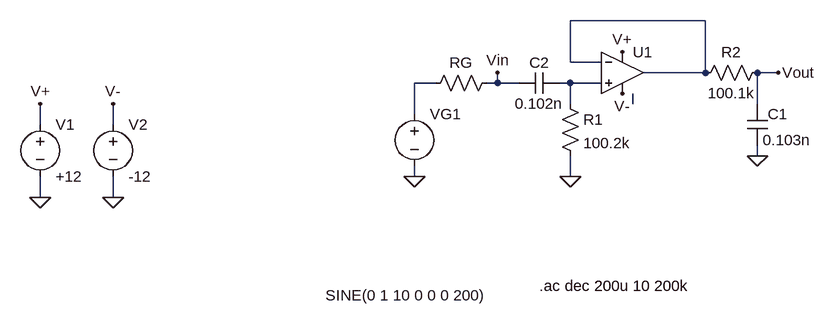
[diagram p0: schematic shaper_bode.asc]
shaper_bode.asc, the LTspice schematic file:
Version 4
SHEET 1 880 680
WIRE -224 -112 -432 -112
WIRE -432 -48 -432 -112
WIRE -384 -48 -432 -48
WIRE -224 -32 -224 -112
WIRE -224 -32 -320 -32
WIRE -112 -32 -144 -32
WIRE -640 -16 -672 -16
WIRE -544 -16 -544 -32
WIRE -544 -16 -560 -16
WIRE -512 -16 -544 -16
WIRE -432 -16 -448 -16
WIRE -384 -16 -432 -16
WIRE -432 16 -432 -16
WIRE -336 16 -336 0
WIRE -144 16 -144 -32
WIRE -672 32 -672 -16
WIRE -1248 48 -1248 16
WIRE -1136 48 -1136 16
WIRE -144 96 -144 80
WIRE -672 128 -672 112
WIRE -432 128 -432 96
WIRE -1248 160 -1248 128
WIRE -1136 160 -1136 128
FLAG -1248 160 0
FLAG -1136 160 0
FLAG -1248 16 V+
FLAG -1136 16 V-
FLAG -112 -32 Vout
FLAG -544 -32 Vin
FLAG -352 0 V-
FLAG -352 -64 V+
FLAG -672 128 0
FLAG -432 128 0
FLAG -144 96 0
SYMBOL voltage -1248 32 R0
WINDOW 123 24 126 Left 2
WINDOW 39 24 111 Left 2
SYMATTR InstName V1
SYMATTR Value +12
SYMBOL voltage -1136 32 R0
WINDOW 123 24 126 Left 2
WINDOW 39 24 111 Left 2
SYMATTR InstName V2
SYMATTR Value -12
SYMBOL Opamps/UniversalOpamp2 -352 -32 R0
SYMATTR InstName U1
SYMBOL voltage -672 16 R0
WINDOW 3 -137 295 Left 2
WINDOW 39 0 0 Left 0
SYMATTR Value SINE(0 1 10 0 0 0 200)
SYMATTR Value2 AC 1 0
SYMATTR InstName VG1
SYMBOL res -544 -32 R90
WINDOW 0 0 56 VBottom 2
WINDOW 3 32 56 Invisible 2
SYMATTR InstName RG
SYMATTR Value 600
SYMBOL res -448 0 R0
SYMATTR InstName R1
SYMATTR Value 100.2k
SYMBOL res -128 -48 R90
WINDOW 0 0 56 VBottom 2
WINDOW 3 32 56 VTop 2
SYMATTR InstName R2
SYMATTR Value 100.1k
SYMBOL cap -160 16 R0
WINDOW 0 32 16 Left 2
SYMATTR InstName C1
SYMATTR Value 0.103n
SYMBOL cap -448 -32 R90
WINDOW 0 0 32 VBottom 2
WINDOW 3 32 32 VTop 2
SYMATTR InstName C2
SYMATTR Value 0.102n
TEXT -480 296 Left 2 !.ac dec 200u 10 200k

The netlist it stands for:
* shaper_bode.asc
V1 V+ 0 +12
V2 V- 0 -12
XU1 N003 N001 V+ V- N001 level.2 Avol=1Meg GBW=10Meg Slew=10Meg ilimit=25m rail=0 Vos=0 phimargin=45 en=0 enk=0 in=0 ink=0 Rin=500Meg  ; pins IN+ IN- V+ V- OUT
VG1 N002 0 SINE(0 1 10 0 0 0 200) AC 1 0
RG Vin N002 600
R1 N003 0 100.2k
R2 Vout N001 100.1k
C1 Vout 0 0.103n
C2 N003 Vin 0.102n
.ac dec 200u 10 200k
.lib UniversalOpamps2.sub
.backanno
.end

* Results of the author's LTspice run, read from the files saved beside the schematic
* Operating Point, zero values left out:
*   V(v+) = 12 V
*   V(v-) = -12 V
*   I(V2) = 1.199 mA
*   I(V1) = -1.199 mA
*   Ix(u1:3) = 1.199 mA
*   Ix(u1:4) = -1.199 mA
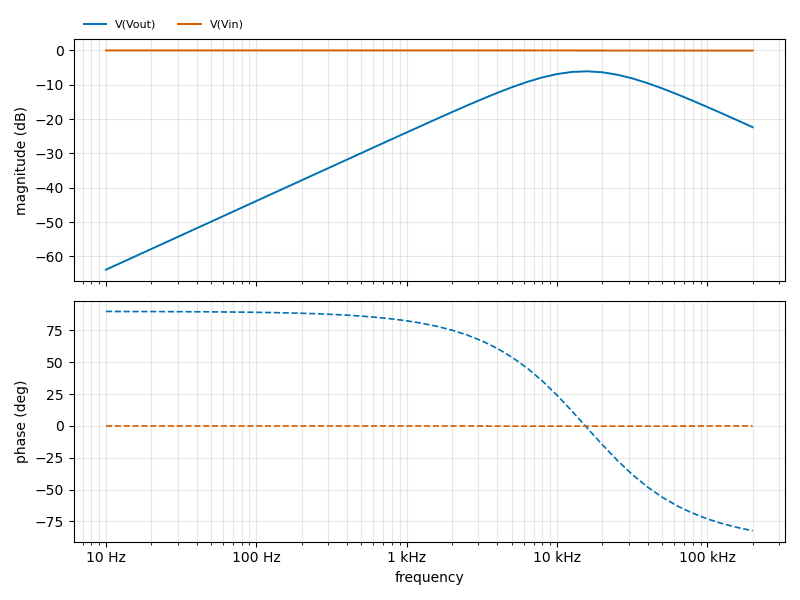
[diagram p1: AC Analysis of shaper_bode.asc, plotted from the saved traces]
* AC Analysis, 1 run:
*   V(Vout): -63.85 dB at 10 Hz, -22.35 dB at 200 kHz, peak -6.09 dB at 15.85 kHz, 3 dB below the peak at 6.409 kHz and 37.19 kHz
*   V(Vin): -0.00 dB at 10 Hz, -0.05 dB at 200 kHz, peak -0.00 dB at 10 Hz